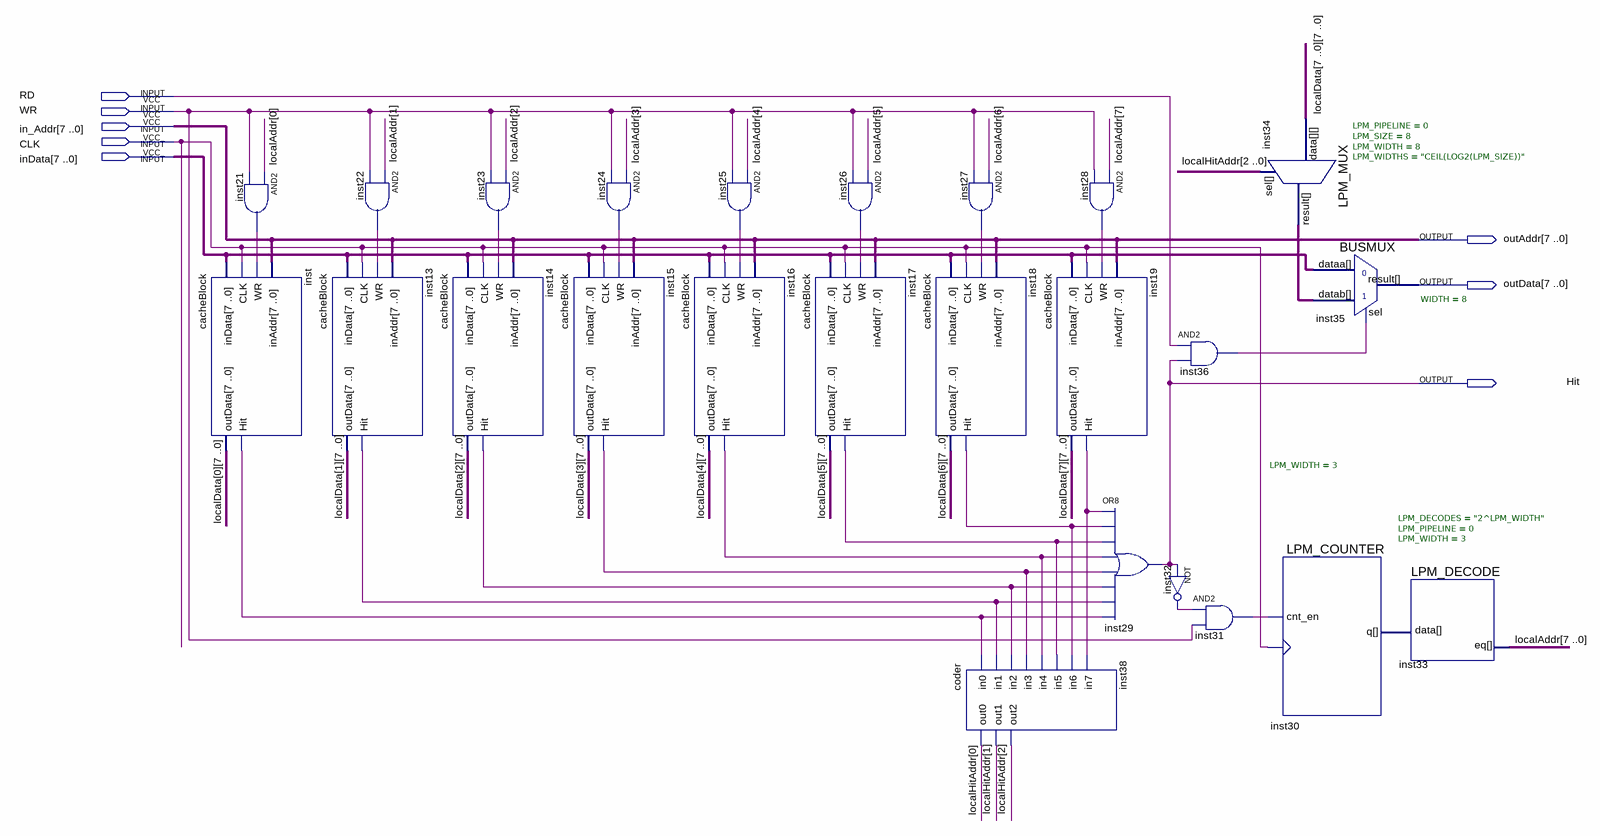
[diagram p0: schematic sheet]
// Quartus schematic cache.bdf as structural Verilog: 25 symbols, 8 pins
module cache (
  input  RD,
  input  WR,
  input  [7:0] in_Addr,
  input  CLK,
  input  [7:0] inData,
  output [7:0] outAddr,
  output [7:0] outData,
  output Hit
);

  wire inst13_hit, inst14_hit, inst15_hit, inst16_hit, inst17_hit, inst18_hit, inst19_hit, inst21_out,
       inst22_out, inst23_out, inst24_out, inst25_out, inst26_out, inst27_out, inst28_out, inst31_out,
       inst32_out, inst36_out, inst_hit;
  wire [2:0] inst30_q, localHitAddr;
  wire [7:0] inst34_result, localAddr, localData_0, localData_1, localData_2, localData_3, localData_4,
       localData_5, localData_6, localData_7;

  and inst21 (inst21_out, localAddr[0], WR);
  cacheBlock inst (
    .inData(inData), .CLK(CLK), .WR(inst21_out), .inAddr(in_Addr), .outData(localData_0), .Hit(inst_hit));
  and inst22 (inst22_out, localAddr[1], WR);
  cacheBlock inst13 (
    .inData(inData), .CLK(CLK), .WR(inst22_out), .inAddr(in_Addr), .outData(localData_1), .Hit(inst13_hit));
  and inst23 (inst23_out, localAddr[2], WR);
  cacheBlock inst14 (
    .inData(inData), .CLK(CLK), .WR(inst23_out), .inAddr(in_Addr), .outData(localData_2), .Hit(inst14_hit));
  and inst24 (inst24_out, localAddr[3], WR);
  cacheBlock inst15 (
    .inData(inData), .CLK(CLK), .WR(inst24_out), .inAddr(in_Addr), .outData(localData_3), .Hit(inst15_hit));
  and inst25 (inst25_out, localAddr[4], WR);
  cacheBlock inst16 (
    .inData(inData), .CLK(CLK), .WR(inst25_out), .inAddr(in_Addr), .outData(localData_4), .Hit(inst16_hit));
  and inst26 (inst26_out, localAddr[5], WR);
  cacheBlock inst17 (
    .inData(inData), .CLK(CLK), .WR(inst26_out), .inAddr(in_Addr), .outData(localData_5), .Hit(inst17_hit));
  and inst27 (inst27_out, localAddr[6], WR);
  cacheBlock inst18 (
    .inData(inData), .CLK(CLK), .WR(inst27_out), .inAddr(in_Addr), .outData(localData_6), .Hit(inst18_hit));
  coder inst38 (
    .in0(inst_hit), .in1(inst13_hit), .in2(inst14_hit), .in3(inst15_hit), .in4(inst16_hit), .in5(inst17_hit),
    .in6(inst18_hit), .in7(inst19_hit), .out0(localHitAddr[0]), .out1(localHitAddr[1]), .out2(localHitAddr[2]));
  and inst28 (inst28_out, localAddr[7], WR);
  cacheBlock inst19 (
    .inData(inData), .CLK(CLK), .WR(inst28_out), .inAddr(in_Addr), .outData(localData_7), .Hit(inst19_hit));
  or inst29 (Hit, inst19_hit, inst18_hit, inst17_hit, inst16_hit, inst15_hit, inst14_hit, inst13_hit, inst_hit);
  and inst36 (inst36_out, RD, Hit);
  not inst32 (inst32_out, Hit);
  and inst31 (inst31_out, inst32_out, WR);
  LPM_MUX #(.LPM_PIPELINE(0), .LPM_SIZE(8), .LPM_WIDTH(8), .LPM_WIDTHS("CEIL(LOG2(LPM_SIZE))")) inst34 (
    .data({localData_7, localData_6, localData_5, localData_4, localData_3, localData_2, localData_1, localData_0}),
    .sel(localHitAddr), .result(inst34_result));
  LPM_COUNTER #(.LPM_WIDTH(3)) inst30 (.cnt_en(inst31_out), .clock(CLK), .q(inst30_q));
  BUSMUX #(.WIDTH(8)) inst35 (.datab(inst34_result), .sel(inst36_out), .dataa(inData), .result(outData));
  LPM_DECODE #(.LPM_DECODES("2^LPM_WIDTH"), .LPM_PIPELINE(0), .LPM_WIDTH(3)) inst33 (.data(inst30_q), .eq(localAddr));

  assign outAddr = in_Addr;
endmodule
